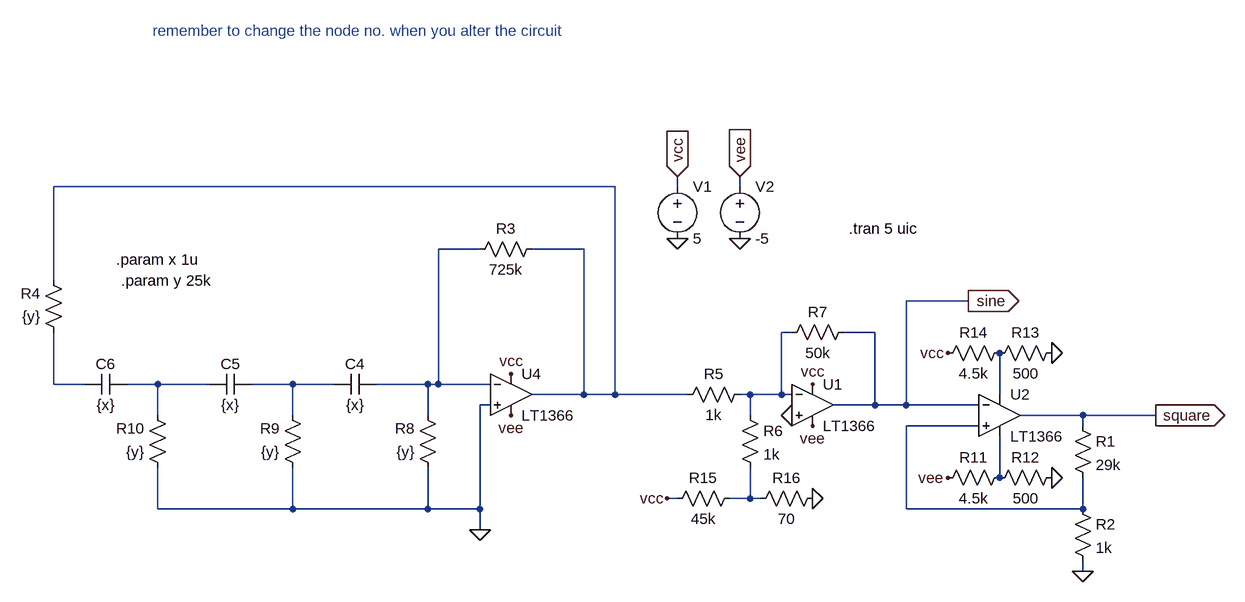
[diagram p0: schematic lfo_FM.asc]
lfo_FM.asc, the LTspice schematic file:
Version 4
SHEET 1 1144 1376
WIRE -576 -144 -1440 -144
WIRE -480 -144 -480 -160
WIRE -384 -144 -384 -160
WIRE -784 -48 -848 -48
WIRE -624 -48 -704 -48
WIRE -1440 0 -1440 -144
WIRE -32 32 -128 32
WIRE -304 80 -320 80
WIRE -176 80 -224 80
WIRE -1440 160 -1440 80
WIRE -1392 160 -1440 160
WIRE -1280 160 -1328 160
WIRE -1200 160 -1280 160
WIRE -1072 160 -1136 160
WIRE -1008 160 -1072 160
WIRE -864 160 -944 160
WIRE -848 160 -848 -48
WIRE -848 160 -864 160
WIRE -768 160 -848 160
WIRE -624 176 -624 -48
WIRE -624 176 -704 176
WIRE -576 176 -576 -144
WIRE -576 176 -624 176
WIRE -464 176 -576 176
WIRE -368 176 -384 176
WIRE -320 176 -320 80
WIRE -320 176 -368 176
WIRE -304 176 -320 176
WIRE 16 176 16 112
WIRE -768 192 -784 192
WIRE -176 192 -176 80
WIRE -176 192 -240 192
WIRE -128 192 -128 32
WIRE -128 192 -176 192
WIRE -16 192 -128 192
WIRE -1280 208 -1280 160
WIRE -1072 208 -1072 160
WIRE -864 208 -864 160
WIRE -368 208 -368 176
WIRE 144 208 48 208
WIRE 256 208 144 208
WIRE -16 224 -128 224
WIRE 144 224 144 208
WIRE 16 304 16 240
WIRE -480 336 -496 336
WIRE -368 336 -368 288
WIRE -368 336 -400 336
WIRE -352 336 -368 336
WIRE -1280 352 -1280 288
WIRE -1072 352 -1072 288
WIRE -1072 352 -1280 352
WIRE -864 352 -864 288
WIRE -864 352 -1072 352
WIRE -784 352 -784 192
WIRE -784 352 -864 352
WIRE -128 352 -128 224
WIRE 144 352 144 304
WIRE 144 352 -128 352
WIRE -784 384 -784 352
WIRE 144 448 144 432
FLAG 144 448 0
FLAG -784 384 0
FLAG -480 -160 vcc
IOPIN -480 -160 In
FLAG -384 -160 vee
IOPIN -384 -160 In
FLAG -736 144 vcc
FLAG -736 208 vee
FLAG 256 208 square
IOPIN 256 208 Out
FLAG -304 208 0
FLAG -272 160 vcc
FLAG -272 224 vee
FLAG 96 112 0
FLAG 96 304 0
FLAG -64 112 vcc
FLAG -64 304 vee
FLAG -272 336 0
FLAG -496 336 vcc
FLAG -32 32 sine
IOPIN -32 32 Out
FLAG -384 -64 0
FLAG -480 -64 0
SYMBOL res 128 208 R0
SYMATTR InstName R1
SYMATTR Value 29k
SYMBOL res 128 336 R0
SYMATTR InstName R2
SYMATTR Value 1k
SYMBOL cap -944 144 R90
WINDOW 0 0 32 VBottom 2
WINDOW 3 32 32 VTop 2
SYMATTR InstName C4
SYMATTR Value {x}
SYMBOL cap -1136 144 R90
WINDOW 0 0 32 VBottom 2
WINDOW 3 32 32 VTop 2
SYMATTR InstName C5
SYMATTR Value {x}
SYMBOL cap -1328 144 R90
WINDOW 0 0 32 VBottom 2
WINDOW 3 32 32 VTop 2
SYMATTR InstName C6
SYMATTR Value {x}
SYMBOL res -848 304 R180
WINDOW 0 36 76 Left 2
WINDOW 3 36 40 Left 2
SYMATTR InstName R8
SYMATTR Value {y}
SYMBOL res -1056 304 R180
WINDOW 0 36 76 Left 2
WINDOW 3 36 40 Left 2
SYMATTR InstName R9
SYMATTR Value {y}
SYMBOL res -1264 304 R180
WINDOW 0 36 76 Left 2
WINDOW 3 36 40 Left 2
SYMATTR InstName R10
SYMATTR Value {y}
SYMBOL Opamps/LT1366 -736 112 R0
SYMATTR InstName U4
SYMBOL Opamps/LT1366 16 144 R0
SYMATTR InstName U2
SYMBOL res -688 -64 R90
WINDOW 0 0 56 VBottom 2
WINDOW 3 32 56 VTop 2
SYMATTR InstName R3
SYMATTR Value 725k
SYMBOL Opamps/LT1366 -272 128 R0
SYMATTR InstName U1
SYMBOL res -368 160 R90
WINDOW 0 0 56 VBottom 2
WINDOW 3 32 56 VTop 2
SYMATTR InstName R5
SYMATTR Value 1k
SYMBOL res -384 192 R0
SYMATTR InstName R6
SYMATTR Value 1k
SYMBOL res -208 64 R90
WINDOW 0 0 56 VBottom 2
WINDOW 3 32 56 VTop 2
SYMATTR InstName R7
SYMATTR Value 50k
SYMBOL res 32 288 R90
WINDOW 0 0 56 VBottom 2
WINDOW 3 32 56 VTop 2
SYMATTR InstName R11
SYMATTR Value 4.5k
SYMBOL res 112 288 R90
WINDOW 0 0 56 VBottom 2
WINDOW 3 32 56 VTop 2
SYMATTR InstName R12
SYMATTR Value 500
SYMBOL res 112 96 R90
WINDOW 0 0 56 VBottom 2
WINDOW 3 32 56 VTop 2
SYMATTR InstName R13
SYMATTR Value 500
SYMBOL res 32 96 R90
WINDOW 0 0 56 VBottom 2
WINDOW 3 32 56 VTop 2
SYMATTR InstName R14
SYMATTR Value 4.5k
SYMBOL res -496 352 R270
WINDOW 0 32 56 VTop 2
WINDOW 3 0 56 VBottom 2
SYMATTR InstName R15
SYMATTR Value 45k
SYMBOL res -368 352 R270
WINDOW 0 32 56 VTop 2
WINDOW 3 0 56 VBottom 2
SYMATTR InstName R16
SYMATTR Value 70
SYMBOL res -1424 96 R180
WINDOW 0 36 76 Left 2
WINDOW 3 36 40 Left 2
SYMATTR InstName R4
SYMATTR Value {y}
SYMBOL voltage -480 -160 R0
SYMATTR InstName V1
SYMATTR Value 5
SYMBOL voltage -384 -160 R0
SYMATTR InstName V2
SYMATTR Value -5
TEXT -1288 -384 Left 2 ;remember to change the node no. when you alter the circuit
TEXT -1344 -32 Left 2 !.param x 1u
TEXT -1336 0 Left 2 !.param y 25k
TEXT -216 -80 Left 2 !.tran 5 uic

The netlist it stands for:
* lfo_FM.asc
R1 square N008 29k
R2 N008 0 1k
C4 N002 N006 {x}
C5 N006 N005 {x}
C6 N005 N004 {x}
R8 0 N002 {y}
R9 0 N006 {y}
R10 0 N005 {y}
XU4 0 N002 vcc vee N001 LT1366  ; pins In+ In- V+ V- OUT
XU2 N008 sine N007 N009 square LT1366  ; pins In+ In- V+ V- OUT
R3 N001 N002 725k
XU1 0 N003 vcc vee sine LT1366  ; pins In+ In- V+ V- OUT
R5 N003 N001 1k
R6 N003 N010 1k
R7 sine N003 50k
R11 N009 vee 4.5k
R12 0 N009 500
R13 0 N007 500
R14 N007 vcc 4.5k
R15 vcc N010 45k
R16 N010 0 70
R4 N004 N001 {y}
V1 vcc 0 5
V2 vee 0 -5
* remember to change the node no. when you alter the circuit
.param x 1u
.param y 25k
.tran 5 uic
.lib LTC.lib
.backanno
.end